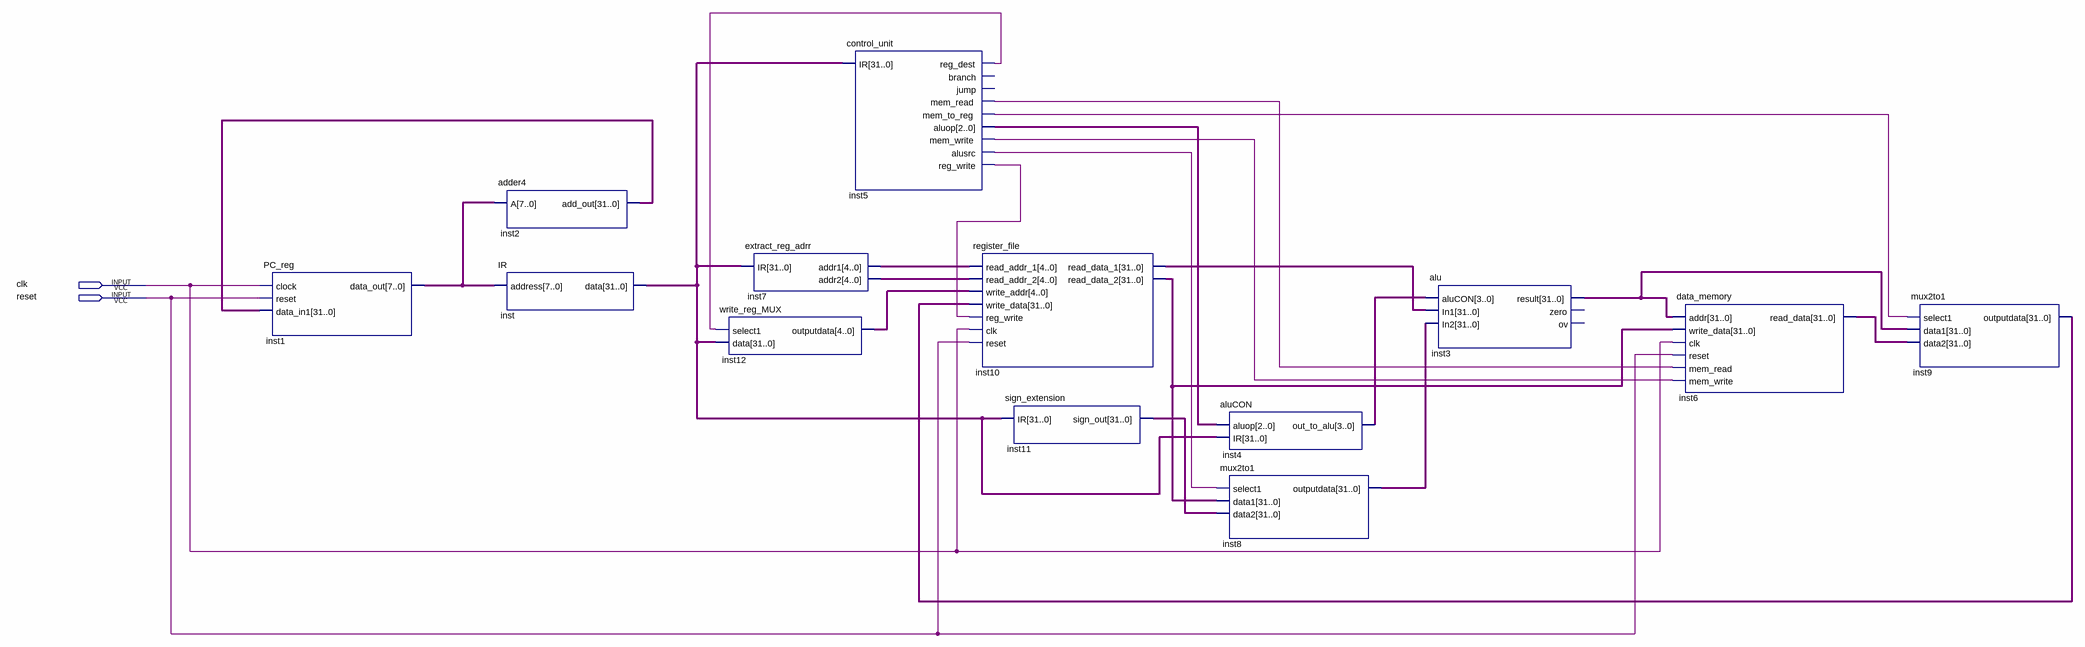
[diagram p0: schematic sheet]
// Quartus schematic mip32.bdf as structural Verilog: 13 symbols, 2 pins
module mip32 (
  input  clk,
  input  reset
);

  wire inst5_alusrc, inst5_mem_read, inst5_mem_to_reg, inst5_mem_write, inst5_reg_dest, inst5_reg_write;
  wire [2:0] inst5_aluop;
  wire [3:0] inst4_out_to_alu;
  wire [4:0] inst7_addr1, inst7_addr2, inst12_outputdata;
  wire [7:0] inst1_data_out;
  wire [31:0] inst2_add_out, inst3_result, inst6_read_data, inst8_outputdata, inst9_outputdata,
       inst10_read_data_1, inst10_read_data_2, inst11_sign_out, inst_data;

  PC_reg inst1 (.clock(clk), .reset(reset), .data_in1(inst2_add_out), .data_out(inst1_data_out));
  adder4 inst2 (.A(inst1_data_out), .add_out(inst2_add_out));
  IR inst (.address(inst1_data_out), .data(inst_data));
  write_reg_MUX inst12 (.select1(inst5_reg_dest), .data(inst_data), .outputdata(inst12_outputdata));
  extract_reg_adrr inst7 (.IR(inst_data), .addr1(inst7_addr1), .addr2(inst7_addr2));
  control_unit inst5 (
    .IR(inst_data), .reg_dest(inst5_reg_dest), .mem_read(inst5_mem_read), .mem_to_reg(inst5_mem_to_reg),
    .aluop(inst5_aluop), .mem_write(inst5_mem_write), .alusrc(inst5_alusrc), .reg_write(inst5_reg_write));  // open: branch, jump
  register_file inst10 (
    .read_addr_1(inst7_addr1), .read_addr_2(inst7_addr2), .write_addr(inst12_outputdata),
    .write_data(inst9_outputdata), .reg_write(inst5_reg_write), .clk(clk), .reset(reset),
    .read_data_1(inst10_read_data_1), .read_data_2(inst10_read_data_2));
  sign_extension inst11 (.IR(inst_data), .sign_out(inst11_sign_out));
  aluCON inst4 (.aluop(inst5_aluop), .IR(inst_data), .out_to_alu(inst4_out_to_alu));
  mux2to1 inst8 (
    .select1(inst5_alusrc), .data1(inst10_read_data_2), .data2(inst11_sign_out), .outputdata(inst8_outputdata));
  alu inst3 (
    .aluCON(inst4_out_to_alu), .In1(inst10_read_data_1), .In2(inst8_outputdata), .result(inst3_result));  // open: zero, ov
  data_memory inst6 (
    .addr(inst3_result), .write_data(inst10_read_data_2), .clk(clk), .reset(reset),
    .mem_read(inst5_mem_read), .mem_write(inst5_mem_write), .read_data(inst6_read_data));
  mux2to1 inst9 (
    .select1(inst5_mem_to_reg), .data1(inst3_result), .data2(inst6_read_data), .outputdata(inst9_outputdata));
endmodule
